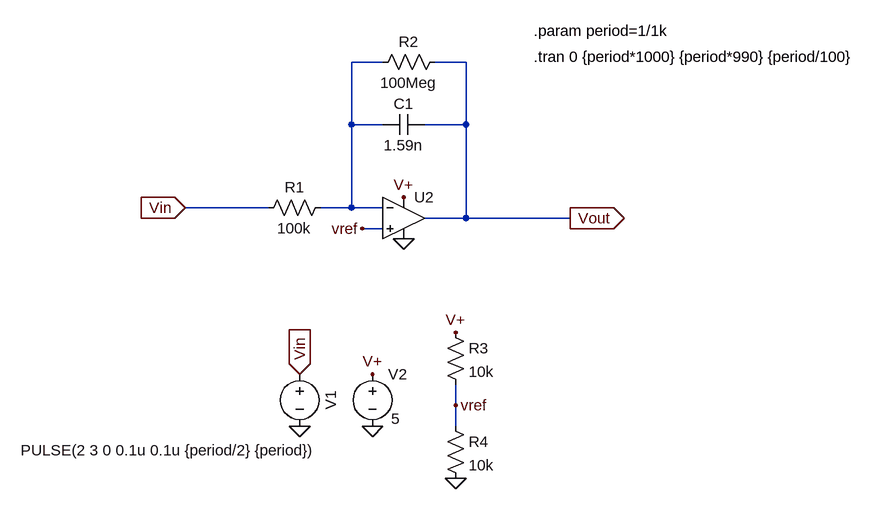
[diagram p0: schematic analogue-PWM-integrator.asc]
analogue-PWM-integrator.asc, the LTspice schematic file:
Version 4
SHEET 1 1108 680
WIRE 192 -80 144 -80
WIRE 320 -80 272 -80
WIRE 144 16 144 -80
WIRE 192 16 144 16
WIRE 320 16 320 -80
WIRE 320 16 256 16
WIRE 16 144 -112 144
WIRE 144 144 144 16
WIRE 144 144 96 144
WIRE 192 144 144 144
WIRE 320 160 320 16
WIRE 320 160 256 160
WIRE 480 160 320 160
WIRE 192 176 160 176
WIRE 304 448 304 416
WIRE 304 480 304 448
FLAG 64 480 0
FLAG 176 480 0
FLAG 176 400 V+
FLAG 224 128 V+
FLAG 304 560 0
FLAG 304 336 V+
FLAG 304 448 vref
FLAG 224 192 0
FLAG 160 176 vref
FLAG 64 400 Vin
IOPIN 64 400 In
FLAG 480 160 Vout
IOPIN 480 160 Out
FLAG -112 144 Vin
IOPIN -112 144 In
SYMBOL res 112 128 R90
WINDOW 0 0 56 VBottom 2
WINDOW 3 32 56 VTop 2
SYMATTR InstName R1
SYMATTR Value 100k
SYMBOL res 288 -96 R90
WINDOW 0 0 56 VBottom 2
WINDOW 3 32 56 VTop 2
SYMATTR InstName R2
SYMATTR Value 100Meg
SYMBOL cap 256 0 R90
WINDOW 0 0 32 VBottom 2
WINDOW 3 32 32 VTop 2
SYMATTR InstName C1
SYMATTR Value 1.59n
SYMBOL voltage 64 384 M0
WINDOW 0 -32 56 VBottom 2
WINDOW 3 200 149 Bottom 2
WINDOW 123 0 0 Left 0
WINDOW 39 0 0 Left 0
SYMATTR InstName V1
SYMATTR Value PULSE(2 3 0 0.1u 0.1u {period/2} {period})
SYMBOL voltage 176 384 R0
WINDOW 123 0 0 Left 0
WINDOW 39 0 0 Left 0
WINDOW 3 29 85 Left 2
SYMATTR InstName V2
SYMATTR Value 5
SYMBOL Opamps\\UniversalOpamp2 224 160 R0
SYMATTR InstName U2
SYMBOL res 288 320 R0
SYMATTR InstName R3
SYMATTR Value 10k
SYMBOL res 288 464 R0
SYMATTR InstName R4
SYMATTR Value 10k
TEXT 424 -128 Left 2 !.param period=1/1k
TEXT 424 -88 Left 2 !.tran 0 {period*1000} {period*990} {period/100}

The netlist it stands for:
* analogue-PWM-integrator.asc
R1 N001 Vin 100k
R2 Vout N001 100Meg
C1 Vout N001 1.59n
V1 Vin 0 PULSE(2 3 0 0.1u 0.1u {period/2} {period})
V2 V+ 0 5
XU2 vref N001 V+ 0 Vout level.2 Avol=1Meg GBW=10Meg Slew=10Meg ilimit=25m rail=0 Vos=0 phimargin=45 en=0 enk=0 in=0 ink=0 Rin=500Meg  ; pins IN+ IN- V+ V- OUT
R3 V+ vref 10k
R4 vref 0 10k
.param period=1/1k
.tran 0 {period*1000} {period*990} {period/100}
.lib UniversalOpamps2.sub
.backanno
.end